# EAGLE design sunclock (EAGLE 9.6.2)
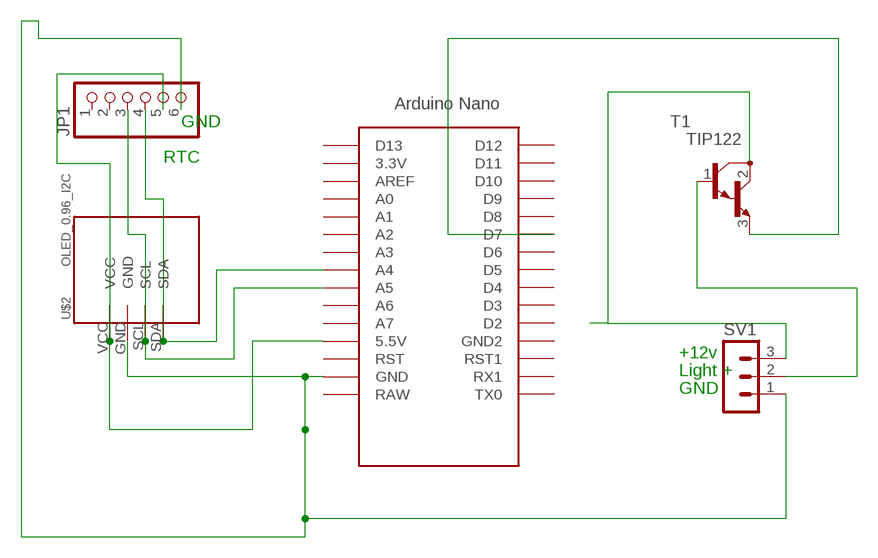
[diagram p0: schematic, sheet 1]

## Parts
JP1  PINHD-1X6  [1X06]
SV1  MA03-1  [MA03-1]
T1  TIP122  [TO220]
U$1  NANO  [NANO]
U$2  OLED_0.96_I2C  [OLED_0.96_I2C]

## Nets
N$1: JP1.5 U$1.5V(5.5V) U$2.VCC
N$3: JP1.3 U$1.A5 U$2.SCL
N$4: JP1.4 U$1.A4 U$2.SDA
N$5: SV1.2 T1.1(B)
N$6: JP1.6 SV1.1 U$1.GND U$2.GND
N$7: SV1.3 T1.2(C)
N$8: T1.3(E) U$1.D7
Unconnected: JP1.1 JP1.2 U$1.3.3V U$1.A0 U$1.A1 U$1.A2 U$1.A3 U$1.A6 U$1.A7 U$1.AREF U$1.D2 U$1.D3 U$1.D4 U$1.D5 U$1.D6 U$1.D8 U$1.D9 U$1.D10 U$1.D11 U$1.D12 U$1.D13 U$1.GND1(GND2) U$1.ICSP1 U$1.ICSP2 U$1.ICSP3 U$1.ICSP4 U$1.ICSP5 U$1.ICSP6 U$1.RAW U$1.RST U$1.RST1 U$1.RX1 U$1.TX0

## Notes on the sheet
- GND
- RTC
- +12v
- Light +
- GND

## Library data of the parts
JP1 = pinhead:PINHD-1X6: PIN HEADER
SV1 = con-lstb:MA03-1: PIN HEADER; OC_FARNELL: unknown; OC_NEWARK: unknown
T1 = TIP122:TIP122: NPN BIPOLAR DARLINGTON TRANSISTOR Check prices <https://pricing.snapeda.com/parts/TIP122/ON%20Semiconductor/view-part?ref=eda>; AVAILABILITY: Good; DESCRIPTION: Bipolar (BJT) Transistor NPN - Darlington 100V 5A 2W Through Hole TO-220AB; MF: ON Semiconductor; MP: TIP122; PACKAGE: TO-220-3 CDIL; PRICE: None; PURCHASE-URL: https://pricing.snapeda.com/search/part/TIP122/?ref=eda
U$1 = Arduino-clone:NANO: Arduino Nano
U$2 = tft_1_8_1_44_oled_0_96:OLED_0.96_I2C

## Board
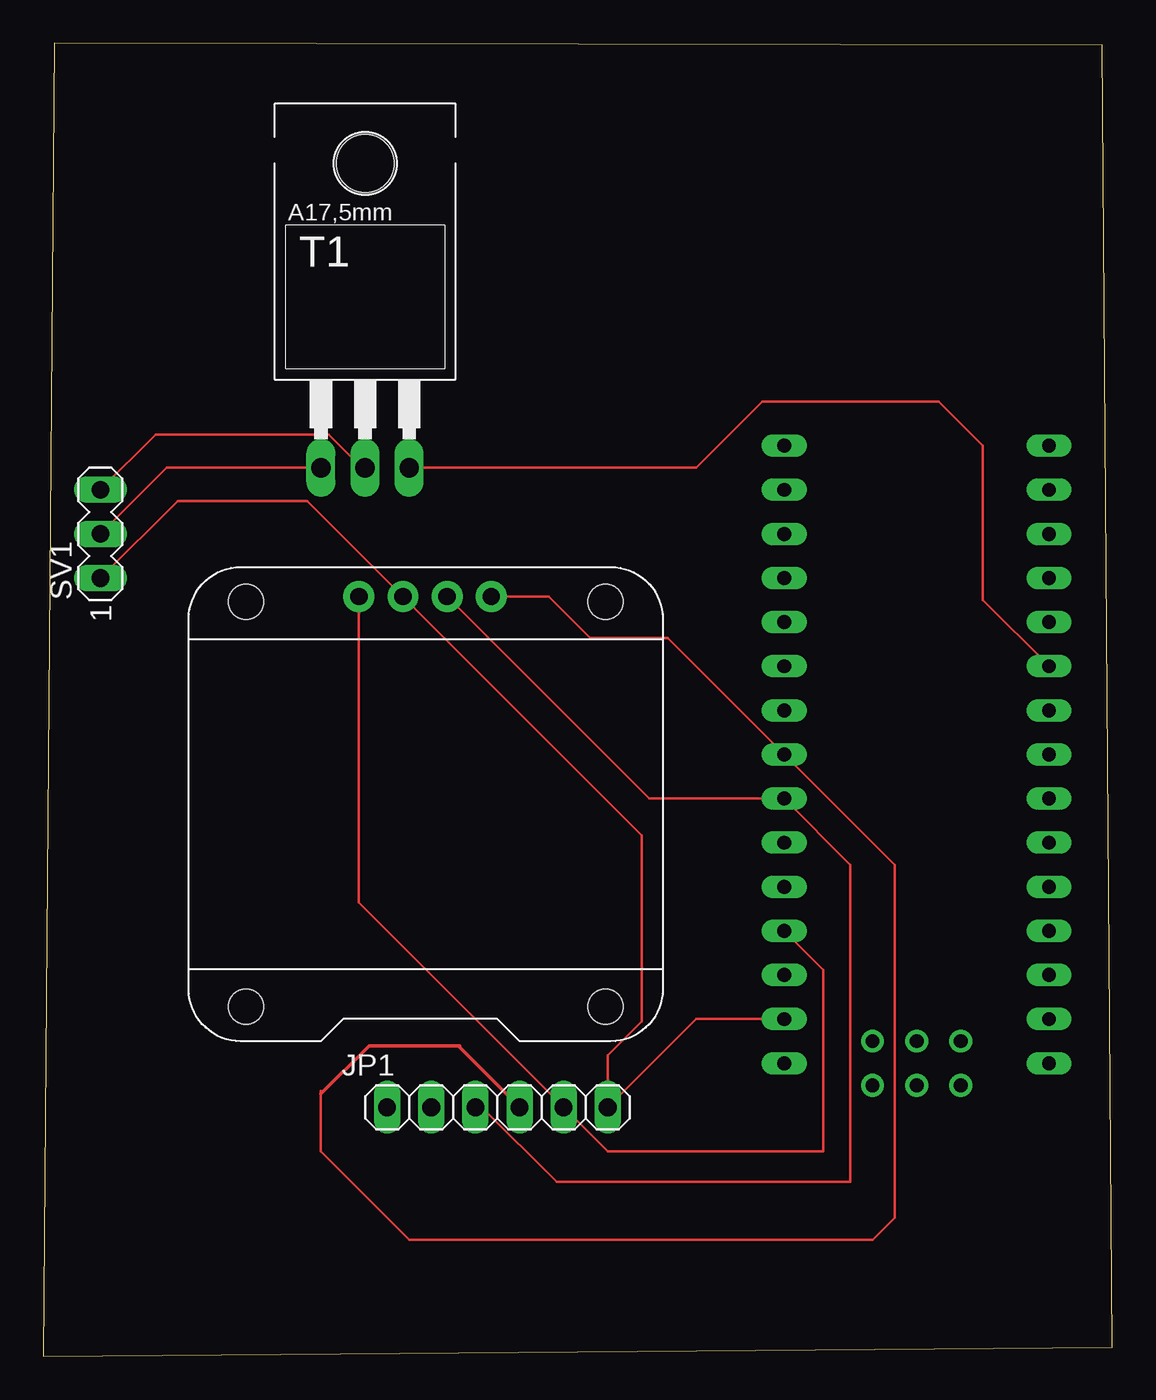
[diagram p1: board, top side]

Size 61.52 x 75.59 mm. Coordinates in mm from the lower left corner, seen from the top.
Outline: 0,0 61.52,0.51 60.94,75.49 0.61,75.59 0,0
Copper layers (1*16): Top 0.035mm / dielectric 1.5mm / Bottom 0.035mm
Design rules "default": minimum track width 6mil, minimum drill 0.35mm, track to track 6mil, track to pad 6mil, pad to pad 6mil, via to via 6mil, smd to smd 6mil, copper to edge 40mil, drill to drill 6mil, minimum pad ring 10mil, minimum via ring 8mil, stop-mask expansion 4mil, vias tented up to drill 0mil, thermal gap 10mil

### Footprints (pad centres in the part's own frame; a part is rotated, then mirrored left to right if it is on the bottom)
1X06 = drill 1.016 long: 1 -6.35,0; 2 -3.81,0; 3 -1.27,0; 4 1.27,0; 5 3.81,0; 6 6.35,0
MA03-1 = drill 1.016 long: 1 -2.54,0; 2 0,0; 3 2.54,0
TO220 = drill 1.118 long: 1 -2.54,-6.35; 2 0,-6.35; 3 2.54,-6.35 | hole 3.302: 0,11.176
NANO = drill 0.8 long: 3.3V -10.16,24.13; 5V -10.16,-1.27; A0 -10.16,19.05; A1 -10.16,16.51; A2 -10.16,13.97; A3 -10.16,11.43; A4 -10.16,8.89; A5 -10.16,6.35; A6 -10.16,3.81; A7 -10.16,1.27; AREF -10.16,21.59; D2 5.08,1.27; D3 5.08,3.81; D4 5.08,6.35; D5 5.08,8.89; D6 5.08,11.43; D7 5.08,13.97; D8 5.08,16.51; D9 5.08,19.05; D10 5.08,21.59; D11 5.08,24.13; D12 5.08,26.67; D13 -10.16,26.67; GND -10.16,-6.35; GND1 5.08,-1.27; RAW -10.16,-8.89; RST -10.16,-3.81; RST1 5.08,-3.81; RX1 5.08,-6.35; TX0 5.08,-8.89 | drill 0.8: ICSP1 -5.08,-10.16; ICSP2 -5.08,-7.62; ICSP3 -2.54,-10.16; ICSP4 -2.54,-7.62; ICSP5 0,-10.16; ICSP6 0,-7.62
OLED_0.96_I2C = drill 1 pad 1.778: GND -1.63,11.63; SCL 0.91,11.63; SDA 3.45,11.63; VCC -4.17,11.63 | hole 2: -10.67,-11.97; 10.03,-11.97; 10.03,11.33; -10.67,11.33

### Placement (x,y rotation side)
JP1  26.14,14.33 0 top
SV1  3.28,47.35 90 top
T1  18.52,57.51 0 top
U$1  52.81,25.76 0 top
U$2  22.33,32.11 0 top

### Tracks (layer width: path | path; a pad name or v marks a point on that pad's centre or on a via)
N$1
  Top 0.152: U$2.VCC 18.16,26.12 JP1.5 32.49,11.79 44.88,11.79 44.88,22.25 U$1.5V
N$3
  Top 0.152: JP1.3 25.24,14.33 29.54,10.03 46.46,10.03 46.46,28.3 U$1.A5 34.87,32.11 U$2.SCL
N$4
  Top 0.152: U$2.SDA 29.1,43.74 31.49,41.34 35.95,41.34 U$1.A4 49,28.3 49,7.98 47.73,6.71 21.06,6.71 15.98,11.79 15.98,15.09 15.98,15.27
  Top 0.203: JP1.4 23.95,17.78 23.95,17.86 18.75,17.86 15.98,15.09
N$5
  Top 0.152: SV1.2 7.09,51.16 T1.1
N$6
  Top 0.152: U$1.GND 37.57,19.41 JP1.6 32.49,17.31 34.45,19.27 34.45,29.98 U$2.GND 15.18,49.25 7.72,49.25 SV1.1
N$7
  Top 0.152: T1.2 18.32,51.16 16.42,53.06 6.45,53.06 SV1.3
N$8
  Top 0.152: T1.3 37.57,51.16 41.38,54.97 51.54,54.97 54.08,52.43 54.08,43.54 U$1.D7